# EAGLE board AFIBRPIComputeBoard (EAGLE 7.3.0)
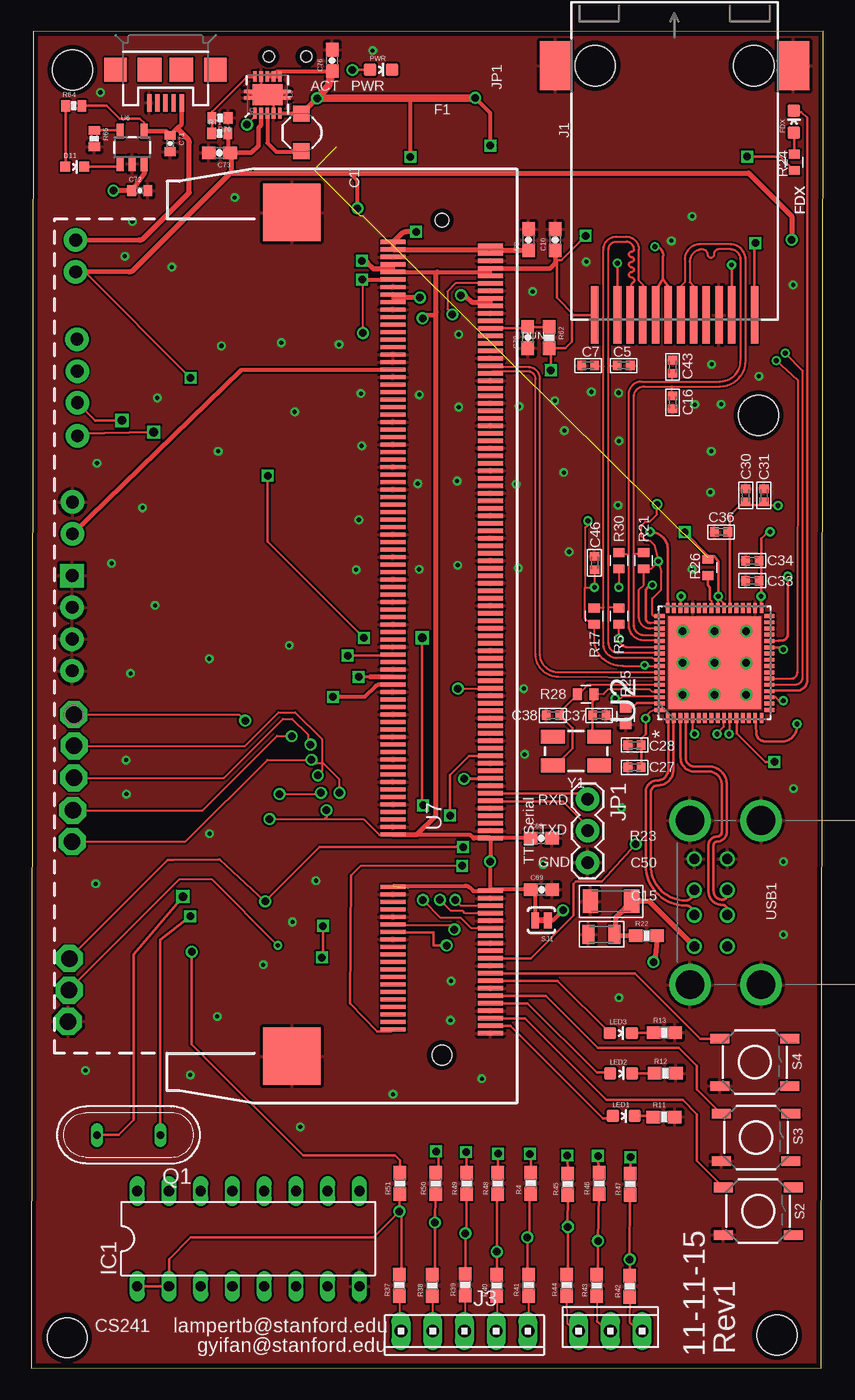
[diagram p3: board, top side]
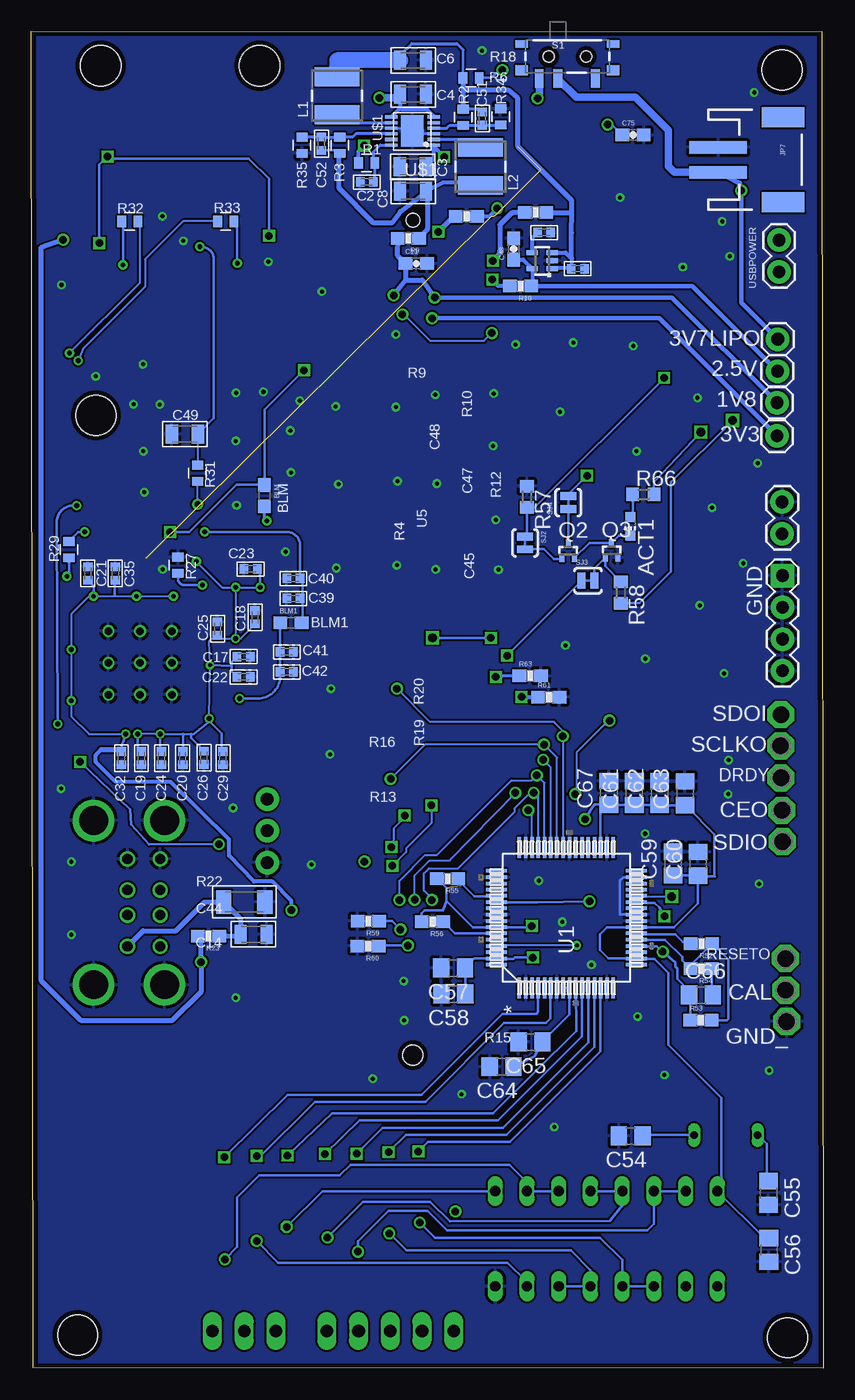
[diagram p4: board, bottom side, seen from below]

Size 63.4 x 106.98 mm. Coordinates in mm from the lower left corner, seen from the top.
Outline: 0,0 63.23,0.05 63.4,106.98 0.15,106.96 0,0
Copper layers (1*16): Top 0.0356mm / dielectric 1.5011mm / Bottom 0.0356mm
Design rules "LaenPCBOrder": minimum track width 6mil, minimum drill 13mil, track to track 6mil, track to pad 6mil, pad to pad 6mil, via to via 6mil, smd to smd 6mil, copper to edge 15mil, drill to drill 6mil, minimum pad ring 7mil, minimum via ring 7mil, stop-mask expansion 3mil, vias tented up to drill 0mil, thermal gap 10mil
Holes 3.2 mm at 3.3,103.89 2.87,2.44 59.69,2.67 58.22,76.25

## Footprints (pad centres in the part's own frame; a part is rotated, then mirrored left to right if it is on the bottom)
1X01 = drill 1.016 pad 1.88: 1 0,0
CHIP-LED0603 = smd 0.8 x 0.8: A 0,-0.75; C 0,0.75
0603 = smd 1.1 x 1: 1 -0.85,0; 2 0.85,0
0402 = smd 0.686 x 0.762: 1 -0.533,0; 2 0.533,0
0805 = smd 0.965 x 1.524: 1 -1.041,0; 2 1.041,0
0603-CAP = smd 1.1 x 1: 1 -0.85,0; 2 0.85,0
1206 = smd 1.219 x 1.88: 1 -1.651,0; 2 1.651,0
C0805 = smd 1.3 x 1.5: 1 -0.95,0; 2 0.95,0
0402-CAP = smd 0.7 x 0.9: 1 -0.65,0; 2 0.65,0
P1-13 = drill 1.321 pad 2.159 octagon: TP 0,0
LED-0603 = smd 0.8 x 0.8: A 0,-0.75; C 0,0.75
LED-0603' = smd 1 x 1: A 0,-0.877; C 0,0.877
1X04 = drill 1.016 pad 1.88 square: 1 0,0 | drill 1.016 pad 1.88: 2 2.54,0; 3 5.08,0; 4 7.62,0
DIL16 = drill 0.813 long: 1 -8.89,-3.81; 2 -6.35,-3.81; 3 -3.81,-3.81; 4 -1.27,-3.81; 5 1.27,-3.81; 6 3.81,-3.81; 7 6.35,-3.81; 8 8.89,-3.81; 9 8.89,3.81; 10 6.35,3.81; 11 3.81,3.81; 12 1.27,3.81; 13 -1.27,3.81; 14 -3.81,3.81; 15 -6.35,3.81; 16 -8.89,3.81
J30 = smd 0.61 x 4.597: 1 -6.401,-19.939; 2 -4.572,-19.939; 3 -3.556,-19.939; 4 -2.54,-19.939; 5 -1.524,-19.939; 6 -0.508,-19.939; 7 0.508,-19.939; 8 1.524,-19.939; 9 2.54,-19.939; 10 3.556,-19.939; 11 4.572,-19.939; 12 6.401,-19.939 | smd 2.489 x 3.912: S1 -9.525,0; S2 9.525,0 | hole 3.251: 6.35,0; -6.35,0
10X03MTA = drill 1.016 long: 1 2.54,0; 2 0,0; 3 -2.54,0
10X05MTA = drill 1.016 long: 1 5.08,0; 2 2.54,0; 3 0,0; 4 -2.54,0; 5 -5.08,0
1X03 = drill 1.016 pad 1.88: 1 0,0; 2 2.54,0; 3 5.08,0
USB-MICRO = smd 0.35 x 1.4: D+ 0,2.65; D- -0.65,2.65; GND 1.3,2.65; ID 0.65,2.65; VBUS -1.3,2.65 | smd 1.8 x 1.9: MT1 -4,0; MT2 4,0 | smd 1.9 x 1.9: P$1 -1.27,0; P$2 1.27,0
1X02 = drill 1.016 pad 1.88: 1 0,0; 2 2.54,0
JST-2-SMD = smd 1 x 4.6: 1 -1,-3.7; 2 1,-3.7 | smd 1.6 x 3.4: NC1 -3.4,1.5; NC2 3.4,1.5
SRN4018 = smd 1.5 x 3.6: P$1 -1.525,0; P$2 1.525,0
CDRH2D09 = smd 1.3 x 1.3: P$1 -1.5,0; P$2 1.5,0
QS = drill 0.61 long: 1 -2.54,0; 2 2.54,0
SC75_INFINEON = smd 0.4 x 0.65: 1 -0.5,-0.575; 2 0,0.575; 3 0.5,-0.575
0402-RES = smd 0.7 x 0.9: 1 -0.65,0; 2 0.65,0
0603-RES = smd 1.1 x 1: 1 -0.85,0; 2 0.85,0
R0603 = smd 1 x 1.1: 1 -0.85,0; 2 0.85,0
SWITCH-SPST-SMD-A = smd 0.7 x 1.5: 1 -2.25,-1.75; 2 -0.75,-1.75; 3 2.25,-1.75 | smd 1 x 0.6: GND1 -3.65,1; GND3 3.65,1 | smd 1 x 0.8: GND2 -3.65,-1.1; GND4 3.65,-1.1 | hole 0.9: -1.5,0; 1.5,0
TACTILE-SWITCH-SMD = smd 1.524 x 0.762: 1 -2.794,1.905; 2 2.794,1.905; 3 -2.794,-1.905; 4 2.794,-1.905
SJ_2S-TRACE = smd 0.635 x 1.27: 1 -0.508,0; 2 0.508,0
ST_64_2 = smd 1.676 x 0.279: 1 -5.613,3.759; 2 -5.613,3.251; 3 -5.613,2.743; 4 -5.613,2.261; 5 -5.613,1.753; 6 -5.613,1.245; 7 -5.613,0.762; 8 -5.613,0.254; 9 -5.613,-0.254; 10 -5.613,-0.762; 11 -5.613,-1.245; 12 -5.613,-1.753; 13 -5.613,-2.261; 14 -5.613,-2.743; 15 -5.613,-3.251; 16 -5.613,-3.759; 33 5.613,-3.759; 34 5.613,-3.251; 35 5.613,-2.743; 36 5.613,-2.261; 37 5.613,-1.753; 38 5.613,-1.245; 39 5.613,-0.762; 40 5.613,-0.254; 41 5.613,0.254; 42 5.613,0.762; 43 5.613,1.245; 44 5.613,1.753; 45 5.613,2.261; 46 5.613,2.743; 47 5.613,3.251; 48 5.613,3.759 | smd 0.279 x 1.676: 17 -3.759,-5.613; 18 -3.251,-5.613; 19 -2.743,-5.613; 20 -2.261,-5.613; 21 -1.753,-5.613; 22 -1.245,-5.613; 23 -0.762,-5.613; 24 -0.254,-5.613; 25 0.254,-5.613; 26 0.762,-5.613; 27 1.245,-5.613; 28 1.753,-5.613; 29 2.261,-5.613; 30 2.743,-5.613; 31 3.251,-5.613; 32 3.759,-5.613; 49 3.759,5.613; 50 3.251,5.613; 51 2.743,5.613; 52 2.261,5.613; 53 1.753,5.613; 54 1.245,5.613; 55 0.762,5.613; 56 0.254,5.613; 57 -0.254,5.613; 58 -0.762,5.613; 59 -1.245,5.613; 60 -1.753,5.613; 61 -2.261,5.613; 62 -2.743,5.613; 63 -3.251,5.613; 64 -3.759,5.613
QFN50P900X900X100-65N = smd 0.813 x 0.305: 1 -4.394,3.759; 2 -4.394,3.251; 3 -4.394,2.743; 4 -4.394,2.261; 5 -4.394,1.753; 6 -4.394,1.245; 7 -4.394,0.762; 8 -4.394,0.254; 9 -4.394,-0.254; 10 -4.394,-0.762; 11 -4.394,-1.245; 12 -4.394,-1.753; 13 -4.394,-2.261; 14 -4.394,-2.743; 15 -4.394,-3.251; 16 -4.394,-3.759; 33 4.394,-3.759; 34 4.394,-3.251; 35 4.394,-2.743; 36 4.394,-2.261; 37 4.394,-1.753; 38 4.394,-1.245; 39 4.394,-0.762; 40 4.394,-0.254; 41 4.394,0.254; 42 4.394,0.762; 43 4.394,1.245; 44 4.394,1.753; 45 4.394,2.261; 46 4.394,2.743; 47 4.394,3.251; 48 4.394,3.759 | smd 0.305 x 0.813: 17 -3.759,-4.394; 18 -3.251,-4.394; 19 -2.743,-4.394; 20 -2.261,-4.394; 21 -1.753,-4.394; 22 -1.245,-4.394; 23 -0.762,-4.394; 24 -0.254,-4.394; 25 0.254,-4.394; 26 0.762,-4.394; 27 1.245,-4.394; 28 1.753,-4.394; 29 2.261,-4.394; 30 2.743,-4.394; 31 3.251,-4.394; 32 3.759,-4.394; 49 3.759,4.394; 50 3.251,4.394; 51 2.743,4.394; 52 2.261,4.394; 53 1.753,4.394; 54 1.245,4.394; 55 0.762,4.394; 56 0.254,4.394; 57 -0.254,4.394; 58 -0.762,4.394; 59 -1.245,4.394; 60 -1.753,4.394; 61 -2.261,4.394; 62 -2.743,4.394; 63 -3.251,4.394; 64 -3.759,4.394 | smd 7.391 x 7.391: 65 0,0 | drill 0.6: GND@1 -2.54,2.54; GND@2 0,2.54; GND@3 2.54,2.54; GND@4 -2.54,0; GND@5 0,0; GND@6 2.54,0; GND@7 -2.54,-2.54; GND@8 0,-2.54; GND@9 2.54,-2.54
SOT353 = smd 0.4 x 0.9: 1 -0.65,-0.8; 2 0,-0.8; 3 0.65,-0.8; 4 0.65,0.8; 5 -0.65,0.8
SOT23-5 = smd 0.55 x 1.2: 1 -0.95,-1.3; 2 0,-1.3; 3 0.95,-1.3; 4 0.95,1.3; 5 -0.95,1.3
SO-DIMM = smd 0.35 x 2: 1 -26.4,-3.9; 2 -26.1,3.9; 3 -25.8,-3.9; 4 -25.5,3.9; 5 -25.2,-3.9; 6 -24.9,3.9; 7 -24.6,-3.9; 8 -24.3,3.9; 9 -24,-3.9; 10 -23.7,3.9; 11 -23.4,-3.9; 12 -23.1,3.9; 13 -22.8,-3.9; 14 -22.5,3.9; 15 -22.2,-3.9; 16 -21.9,3.9; 17 -21.6,-3.9; 18 -21.3,3.9; 19 -21,-3.9; 20 -20.7,3.9; 21 -20.4,-3.9; 22 -20.1,3.9; 23 -19.8,-3.9; 24 -19.5,3.9; 25 -19.2,-3.9; 26 -18.9,3.9; 27 -18.6,-3.9; 28 -18.3,3.9; 29 -18,-3.9; 30 -17.7,3.9; 31 -17.4,-3.9; 32 -17.1,3.9; 33 -16.8,-3.9; 34 -16.5,3.9; 35 -16.2,-3.9; 36 -15.9,3.9; 37 -15.6,-3.9; 38 -15.3,3.9; 39 -15,-3.9; 40 -14.7,3.9; 41 -10.8,-3.9; 42 -10.5,3.9; 43 -10.2,-3.9; 44 -9.9,3.9; 45 -9.6,-3.9; 46 -9.3,3.9; 47 -9,-3.9; 48 -8.7,3.9; 49 -8.4,-3.9; 50 -8.1,3.9; 51 -7.8,-3.9; 52 -7.5,3.9; 53 -7.2,-3.9; 54 -6.9,3.9; 55 -6.6,-3.9; 56 -6.3,3.9; 57 -6,-3.9; 58 -5.7,3.9; 59 -5.4,-3.9; 60 -5.1,3.9; 61 -4.8,-3.9; 62 -4.5,3.9; 63 -4.2,-3.9; 64 -3.9,3.9; 65 -3.6,-3.9; 66 -3.3,3.9; 67 -3,-3.9; 68 -2.7,3.9; 69 -2.4,-3.9; 70 -2.1,3.9; 71 -1.8,-3.9; 72 -1.5,3.9; 73 -1.2,-3.9; 74 -0.9,3.9; 75 -0.6,-3.9; 76 -0.3,3.9; 77 0,-3.9; 78 0.3,3.9; 79 0.6,-3.9; 80 0.9,3.9; 81 1.2,-3.9; 82 1.5,3.9; 83 1.8,-3.9; 84 2.1,3.9; 85 2.4,-3.9; 86 2.7,3.9; 87 3,-3.9; 88 3.3,3.9; 89 3.6,-3.9; 90 3.9,3.9; 91 4.2,-3.9; 92 4.5,3.9; 93 4.8,-3.9; 94 5.1,3.9; 95 5.4,-3.9; 96 5.7,3.9; 97 6,-3.9; 98 6.3,3.9; 99 6.6,-3.9; 100 6.9,3.9; 101 7.2,-3.9; 102 7.5,3.9; 103 7.8,-3.9; 104 8.1,3.9; 105 8.4,-3.9; 106 8.7,3.9; 107 9,-3.9; 108 9.3,3.9; 109 9.6,-3.9; 110 9.9,3.9; 111 10.2,-3.9; 112 10.5,3.9; 113 10.8,-3.9; 114 11.1,3.9; 115 11.4,-3.9; 116 11.7,3.9; 117 12,-3.9; 118 12.3,3.9; 119 12.6,-3.9; 120 12.9,3.9; 121 13.2,-3.9; 122 13.5,3.9; 123 13.8,-3.9; 124 14.1,3.9; 125 14.4,-3.9; 126 14.7,3.9; 127 15,-3.9; 128 15.3,3.9; 129 15.6,-3.9; 130 15.9,3.9; 131 16.2,-3.9; 132 16.5,3.9; 133 16.8,-3.9; 134 17.1,3.9; 135 17.4,-3.9; 136 17.7,3.9; 137 18,-3.9; 138 18.3,3.9; 139 18.6,-3.9; 140 18.9,3.9; 141 19.2,-3.9; 142 19.5,3.9; 143 19.8,-3.9; 144 20.1,3.9; 145 20.4,-3.9; 146 20.7,3.9; 147 21,-3.9; 148 21.3,3.9; 149 21.6,-3.9; 150 21.9,3.9; 151 22.2,-3.9; 152 22.5,3.9; 153 22.8,-3.9; 154 23.1,3.9; 155 23.4,-3.9; 156 23.7,3.9; 157 24,-3.9; 158 24.3,3.9; 159 24.6,-3.9; 160 24.9,3.9; 161 25.2,-3.9; 162 25.5,3.9; 163 25.8,-3.9; 164 26.1,3.9; 165 26.4,-3.9; 166 26.7,3.9; 167 27,-3.9; 168 27.3,3.9; 169 27.6,-3.9; 170 27.9,3.9; 171 28.2,-3.9; 172 28.5,3.9; 173 28.8,-3.9; 174 29.1,3.9; 175 29.4,-3.9; 176 29.7,3.9; 177 30,-3.9; 178 30.3,3.9; 179 30.6,-3.9; 180 30.9,3.9; 181 31.2,-3.9; 182 31.5,3.9; 183 31.8,-3.9; 184 32.1,3.9; 185 32.4,-3.9; 186 32.7,3.9; 187 33,-3.9; 188 33.3,3.9; 189 33.6,-3.9; 190 33.9,3.9; 191 34.2,-3.9; 192 34.5,3.9; 193 34.8,-3.9; 194 35.1,3.9; 195 35.4,-3.9; 196 35.7,3.9; 197 36,-3.9; 198 36.3,3.9; 199 36.6,-3.9; 200 36.9,3.9 | smd 4.6 x 4.6: G1 -28.254,12; G2 39.27,12 | hole 1.6: -28.15,0 | hole 1.1: 38.65,0
QFN-10_PAD = smd 0.297 x 0.85: 1 -1,-1.475; 2 -0.5,-1.475; 3 0,-1.475; 4 0.5,-1.475; 5 1,-1.475; 6 1,1.475; 7 0.5,1.475; 8 0,1.475; 9 -0.5,1.475; 10 -1,1.475 | smd 0.7 x 0.28: 11 -1.5,0.25; 12 -1.5,-0.25; 13 1.5,0.25; 14 1.5,-0.25 | smd 2.4 x 1.65: 15 0,0
WDFN-12L = smd 1 x 0.25: 1 -2.2,3.6; 2 -2.2,3.15; 3 -2.2,2.7; 4 -2.2,2.25; 5 -2.2,1.8; 6 -2.2,1.35; 7 1.2,1.35; 8 1.2,1.8; 9 1.2,2.25; 10 1.2,2.7; 11 1.2,3.15; 12 1.2,3.6 | smd 1.8 x 2.525: GND -0.5,2.48
72309 = drill 0.813: A1_5V+ -3.5,2.62; A2_D- -1,2.62; A3_D+ 1,2.62; A4_GND 3.5,2.62; B1_5V+ -3.5,0; B2_D- -1,0; B3_D+ 1,0; B4_GND 3.5,0 | drill 2.3: GND@1 -6.57,2.97; GND@2 -6.57,-2.71; GND@3 6.57,-2.71; GND@4 6.57,2.97
CRYSTAL-SMD-5X3 = smd 1.9 x 1.1: 1 -1.85,-1.15; 2 1.85,-1.15; 3 1.85,1.15; 4 -1.85,1.15

## Placement (x,y rotation side)
1V8  M01PTH  [1X01]  3.71,77.27 0 bottom
2.5V  M01PTH  [1X01]  3.68,79.78 0 bottom
3V3  M01PTH  [1X01]  3.71,74.6 0 bottom
3V7LIPO  M01PTH  [1X01]  3.66,82.35 90 bottom
ACT1  [CHIP-LED0603]  15.47,67.36 180 bottom
BLM  BLM18AG601  [0603]  44.73,69.82 270 bottom
BLM1  BLM18AG601  [0603]  42.62,59.64 0 bottom
C2  100nF  [0402]  36.55,94.92 180 bottom
C3  10uF  [0805]  32.87,96.14 180 bottom
C4  10uF  [0805]  32.84,101.93 0 bottom
C5  15pf 50V 5%  [0402]  47.42,80.24 0 top
C6  10uF  [0805]  32.84,104.65 0 bottom
C7  15pf 50V 5%  [0402]  44.58,80.24 180 top
C8  10uF  [0805]  32.84,94.18 180 bottom
C9  47uF  [0603-CAP]  39.8,90.3 90 top
C10  47uF  [0603-CAP]  41.94,90.3 90 top
C11  47uF  [0603-CAP]  32.59,88.39 0 bottom
C14  100uF 10v  [1206]  46.41,37.36 180 top
C15  100uF 10v  [1206]  46.36,37.31 0 bottom
C16  15pf 50V 5%  [0402]  51.33,77.29 270 top
C17  100nF  [0402]  46.41,56.95 0 bottom
C18  100nF  [0402]  45.49,60.1 90 bottom
C19  100nF  [0402]  54.58,48.82 270 bottom
C20  100nF  [0402]  51.28,48.82 270 bottom
C21  4u7  [0402]  58.88,63.6 90 bottom
C22  100nF  [0402]  46.41,55.32 0 bottom
C23  100nF  [0402]  45.85,63.96 180 bottom
C24  100nF  [0402]  52.98,48.82 270 bottom
C25  100nF  [0402]  48.49,59.18 90 bottom
C26  100nF  [0402]  49.58,48.84 270 bottom
C27  100nF  [0402]  48.29,48.08 180 top
C28  100nF  [0402]  48.29,49.86 180 top
C29  100nF  [0402]  48.06,48.82 270 bottom
C30  100nF  [0402]  57.18,69.85 90 top
C31  100nF  [0402]  58.65,69.85 90 top
C32  100nF  [0402]  56.18,48.82 270 bottom
C33  100nF  [0402]  57.71,63.02 180 top
C34  100nF  [0402]  57.71,64.62 180 top
C35  100nF  [0402]  56.67,63.6 90 bottom
C36  4u7  [0402]  55.22,66.93 180 top
C37  12pf  [0402]  45.47,52.25 0 top
C38  12pf  [0402]  41.76,52.25 180 top
C39  100nF  [0402]  42.42,61.59 180 bottom
C40  100nF  [0402]  42.42,63.2 180 bottom
C41  100nF  [0402]  42.95,57.33 0 bottom
C42  100nF  [0402]  42.95,55.73 0 bottom
C43  15pf 50V 5%  [0402]  51.33,80.14 90 top
C44  47uf 10v  [0805]  45.64,34.72 180 top
C45  1uF  [0402]  19.66,87.99 0 bottom
C46  100nF  [0402]  45.09,64.44 90 top
C47  100nF  [0402]  22.35,90.88 0 bottom
C48  4.7uF  [0603-CAP]  24.79,89.56 90 bottom
C49  22nF  [0805]  51.1,74.75 180 bottom
C50  47uF 10V  [0805]  45.62,34.72 0 bottom
C51  100pF  [0402]  27.3,100 270 bottom
C52  100pF  [0402]  40.18,97.99 90 bottom
C54  15pF  [C0805]  15.42,18.59 180 bottom
C55  15pF  [C0805]  4.39,14.02 270 bottom
C56  0.1uF  [C0805]  4.37,9.47 270 bottom
C57  0.1uF  [C0805]  29.64,32.03 180 bottom
C58  0.1uF  [C0805]  29.62,29.95 180 bottom
C59  0.1uF  [C0805]  12.04,40.39 90 bottom
C60  4.7uF  [C0805]  10.03,40.36 90 bottom
C61  4.7uF  [C0805]  15.14,46.02 90 bottom
C62  0.1uF  [C0805]  13.11,46.02 90 bottom
C63  0.1uF  [C0805]  11.07,46 90 bottom
C64  10uF  [C0805]  25.76,24.13 180 bottom
C65  0.1uF  [C0805]  23.44,26.11 180 bottom
C66  2.2nF  [C0805]  9.8,29.87 0 bottom
C67  4.7uF  [C0805]  17.17,46.05 90 bottom
C68  10u  [0603-CAP]  40.82,42.42 0 top
C69  10u  [0603-CAP]  40.84,38.3 0 top
C70  0.1uF  [0603-CAP]  39.75,82.47 90 top
C71  4.7uF  [0402-CAP]  11.13,97.99 270 top
C72  4.7uF  [0402-CAP]  8.69,94.23 0 top
C73  22uF  [0603-CAP]  15.06,97.26 180 top
C75  0.1uF  [0603-CAP]  15.24,98.68 0 bottom
C76  10uF  [0603-CAP]  24.08,104.65 90 top
CAL  TPPAD1-13  [P1-13]  3.02,30.25 270 bottom
CEO  TPPAD1-13  [P1-13]  3.33,44.65 90 bottom
D11  CHARGING  [LED-0603]  3.48,96.14 270 top
DRDY  TPPAD1-13  [P1-13]  3.4,47.24 90 bottom
FDX  GREEN  [LED-0603']  61.04,99.75 0 top
GND  [1X04]  3.28,63.42 270 bottom
GND_  TPPAD1-13  [P1-13]  2.95,27.74 90 bottom
IC1  SP720  [DIL16]  17.37,10.36 0 top
J1  J3011  [J30]  51.49,104.22 0 top
J2  JUMPERS  [10X03MTA]  46.36,2.97 0 top
J3  JUMPERS  [10X05MTA]  34.67,2.97 180 top
JP1  [1X03]  44.53,45.54 270 top
JP3  USB-IDMICRO  [USB-MICRO]  10.74,103.91 180 top
JP4  TVDAC  [1X02]  3.3,66.78 90 bottom
JP7  LiPo Battery  [JST-2-SMD]  4.72,96.7 270 bottom
L1  4.7u 2A  [SRN4018]  38.91,101.83 90 bottom
L2  4.7u 2A  [SRN4018]  27.46,96.16 270 bottom
L3  4.7uH, 1.2A  [CDRH2D09]  21.62,98.88 90 top
LED1  [LED-0603']  47.42,20.19 270 top
LED2  [LED-0603']  47.22,23.6 270 top
LED3  [LED-0603']  47.19,26.82 270 top
PWR  RED  [LED-0603']  27.99,103.91 270 top
Q1  8.192MHz  [QS]  7.8,18.67 180 top
Q2  DMG1012T  [SC75_INFINEON]  20.42,65.43 0 bottom
Q3  DMG1012T  [SC75_INFINEON]  16.97,65.46 0 bottom
R1  100K 1%  [0402-RES]  36.55,96.44 180 bottom
R2  540k 1%  [0402-RES]  28.83,100.1 90 bottom
R3  240k 1%  [0402-RES]  38.71,97.87 270 bottom
R4  500  [0603-RES]  39.98,14.81 90 top
R5  49R9 1%  [0402-RES]  47.04,60.17 90 top
R6  470R 1%  [0402-RES]  28.19,103.25 180 bottom
R7  0R 1%  [0603-RES]  28.58,92.18 180 bottom
R8  0R 1%  [0603-RES]  23.04,92.48 180 bottom
R9  0R 1%  [0603-RES]  33.22,90.42 180 bottom
R10  0R 1%  [0603-RES]  24.23,86.59 180 bottom
R11  [0603-RES]  50.65,20.12 0 top
R12  [0603-RES]  50.75,23.6 0 top
R13  [0603-RES]  50.67,26.87 0 top
R17  49R9 1%  [0402-RES]  45.06,60.17 90 top
R21  49R9 1%  [0402-RES]  49.02,64.62 90 top
R22  0R 1%  [0603-RES]  49.25,34.62 0 top
R23  0R 1%  [0603-RES]  49.23,34.59 180 bottom
R24  1K0 1%  [0402-RES]  61.06,96.49 90 top
R25  12K 1%  [0402-RES]  47.57,52.17 90 top
R26  10K 1%  [0402-RES]  54.15,64.08 270 top
R27  12K4 1%  [0402-RES]  51.66,64.26 270 bottom
R28  1M0 1%  [0402-RES]  44.37,53.92 180 top
R29  10K 1%  [0402-RES]  60.38,65.51 90 bottom
R30  49R9 1%  [0402-RES]  47.04,64.62 90 top
R31  10R 1%  [0402-RES]  50.09,71.63 90 bottom
R32  1K0 1%  [0402-RES]  55.52,91.77 0 bottom
R33  1K0 1%  [0402-RES]  47.83,91.77 180 bottom
R34  120k 1%  [0402-RES]  25.83,100.13 270 bottom
R35  120k 1%  [0402-RES]  41.73,97.87 90 bottom
R37  4.5k  [0603-RES]  29.46,6.65 90 top
R38  4.5k  [0603-RES]  32.11,6.63 90 top
R39  4.5k  [0603-RES]  34.72,6.68 90 top
R40  4.5k  [0603-RES]  37.26,6.63 90 top
R41  4.5k  [0603-RES]  39.8,6.65 90 top
R42  4.5k  [0603-RES]  47.9,6.55 90 top
R43  4.5k  [0603-RES]  45.26,6.63 90 top
R44  4.5k  [0603-RES]  42.85,6.65 90 top
R45  500  [0603-RES]  42.95,14.73 90 top
R46  500  [0603-RES]  45.44,14.78 90 top
R47  500  [0603-RES]  47.93,14.73 90 top
R48  500  [0603-RES]  37.34,14.78 90 top
R49  500  [0603-RES]  34.85,14.78 90 top
R50  500  [0603-RES]  32.36,14.78 90 top
R51  500  [0603-RES]  29.51,14.78 90 top
R52  40K  [0603-RES]  9.75,33.99 180 bottom
R53  4M  [0603-RES]  9.8,27.84 0 bottom
R54  100K  [0603-RES]  9.78,31.98 180 bottom
R55  5K  [0603-RES]  30.07,39.19 180 bottom
R56  5K  [0603-RES]  31.29,35.74 180 bottom
R57  47k  [R0603]  23.72,69.72 270 bottom
R58  47k  [R0603]  16.21,62.08 270 bottom
R59  100k  [0603-RES]  36.42,35.79 180 bottom
R60  100k  [0603-RES]  36.45,33.78 180 bottom
R61  100k  [0603-RES]  21.97,53.7 0 bottom
R62  10K  [0603-RES]  41.45,82.47 270 top
R63  100k  [0603-RES]  23.47,55.4 0 bottom
R64  330  [0402-RES]  3.4,101.02 0 top
R65  2K  [0402-RES]  5.05,98.4 270 top
R66  1k8  [R0603]  14.4,69.93 0 bottom
R70  220k  [0402-RES]  15.11,100.05 180 top
R71  2M  [0402-RES]  15.09,98.81 0 top
RESETO  TPPAD1-13  [P1-13]  3.05,32.79 270 bottom
S1  [SWITCH-SPST-SMD-A]  20.5,104.95 0 bottom
S2  SWITCH-MOMENTARY-2SMD  [TACTILE-SWITCH-SMD]  58.19,12.57 0 top
S3  SWITCH-MOMENTARY-2SMD  [TACTILE-SWITCH-SMD]  58.01,18.47 0 top
S4  SWITCH-MOMENTARY-2SMD  [TACTILE-SWITCH-SMD]  57.91,24.49 0 top
SCLKO  TPPAD1-13  [P1-13]  3.43,49.81 90 bottom
SDIO  TPPAD1-13  [P1-13]  3.28,42.14 90 bottom
SDOI  TPPAD1-13  [P1-13]  3.4,52.3 90 top
SJ1  SOLDERJUMPERTRACE  [SJ_2S-TRACE]  40.84,35.84 180 top
SJ2  SOLDERJUMPERTRACE  [SJ_2S-TRACE]  23.88,66.04 270 bottom
SJ3  SOLDERJUMPERTRACE  [SJ_2S-TRACE]  18.85,63.02 0 bottom
SJ4  SOLDERJUMPERTRACE  [SJ_2S-TRACE]  20.42,69.27 90 bottom
U1  ADAS1000BSTZ  [ST_64_2]  20.57,36.04 90 bottom
U2  LAN9512-JZX  [QFN50P900X900X100-65N]  54.69,56.44 90 top
U5  AP7115-25SEG  [SOT353]  22.5,88.62 90 bottom
U6  MCP73831  [SOT23-5]  8.08,97.69 0 top
U7  RASPI  [SO-DIMM]  32.87,53.21 90 top
U8  TPS61200  [QFN-10_PAD]  18.9,101.9 0 top
U$1  [WDFN-12L]  33.4,101.47 180 bottom
USB1  72309USB-TYPE-A  [72309]  55.7,37.26 90 top
USBPOWER  [1X02]  3.56,87.73 90 bottom
Y1  [CRYSTAL-SMD-5X3]  43.61,49.38 0 top

## Tracks (layer width: path | path; a pad name or v marks a point on that pad's centre or on a via)
1V8
  Bottom 0.203: C52.1 38.71,97.46 R3.2
  Bottom 0.305: L2.P$2 27.51,94.64 27.74,94.87 30.45,94.87 C8.1
  Bottom 0.406: R9.1 31.7,91.15 31.7,93.5 C8.1 31.78,93.8 32.03,93.9 33.86,92.56 34.54,91.64 35.99,91.64 38.76,94.41 38.76,97.17 R3.2
3V3  (via drill 0.38, 0.6)  (4 unrouted)
  Top 0.152: v52.02,61.77 52.02,61.42 51.94,61.34 U2.46
  Top 0.178: v55.85,50.75 55.93,51.36 U2.11 | U2.39 55.4,60.88 55.4,61.24 55.04,61.59 v54.99,61.77 54.99,60.93 U2.40 | 54.57,64.97 54.33,64.97 54.2,64.85
  Top 0.203: 54.57,64.97 54.69,64.97 54.99,64.57 v54.99,61.77 | v58.42,61.77 58.42,62.84 | 58.42,62.84 58.42,64.44 | 58.42,64.44 58.42,66.4 58.95,66.93 v59.13,66.93 | C33.1 58.42,62.84 | C34.1 58.42,64.44 | U2.27 60.02,57.68 v60.2,57.51 | v60.2,53.42 59.84,53.42 59.56,53.7 59.21,53.7 59.13,53.64 U2.19 | 58.42,60.78 58.45,60.81 U2.33
  Top 0.254: 58.42,60.78 v58.42,61.77
  Top 0.305: SJ1.1 41.76,35.84 v42.57,36.65
  Bottom 0.178: v55.85,50.75 58.78,50.75 60.2,52.17 v60.2,53.42 v60.2,57.51 60.2,60.35 58.78,61.77 v58.42,61.77 56.72,61.77 v54.99,61.77 v52.02,61.77
  Bottom 0.203: v59.13,66.93 59.66,66.93 60.38,66.22 R29.2 | C21.1 58.42,62.61 v58.42,61.77 | C35.1 56.72,63.17 56.72,61.77 | v55.85,50.75 56.03,50.11 56.18,49.86 C32.1 | 28.84,105.5 R6.2
  Bottom 0.254: C6.1 33.88,105.05 32.94,105.99 29.34,105.99 28.84,105.5 | C51.1 27.52,100.75 R2.2 | R6.2 28.83,103.24
  Bottom 0.305: L1.P$2 38.99,103.35 39.12,103.23 | 21.97,89.31 21.93,89.27 U5.3 20.64,89.27 20.17,88.8 20.17,88.01 C45.1 20.27,88.06 21.56,88.06 21.66,87.97 U5.1 | 28.7,102.26 28.83,102.23 | v42.57,36.65 42.57,37.41 44.09,38.94 45.57,38.94 47.57,41.02 47.57,42.32 52.25,46.91 56.64,46.91 58.24,48.51 58.24,49.07 57.81,49.5
  Bottom 0.406: 28.83,103.24 28.83,102.23 R2.2 | 20.17,88.8 20.16,90.83 20.15,92.55 | 20.15,92.55 20.14,93.45 24.43,97.74 24.46,101.63 25.2,102.26 28.7,102.26 | R8.1 20.32,92.48 arc-45 20.15,92.55 | 57.81,49.5 56.18,49.5 C32.1
  Bottom 1.27: C6.1 38.91,104.65 L1.P$2
3V3_AN  (via drill 0.33, 0.38, 0.5)
  Top 0.152: U2.51 49.53,59.18 arc-90 48.64,60.07 48.64,62.31 49.02,62.69 R21.1
  Top 0.178: 50.24,57.68 47.75,57.68 arc-90 v47.04,58.39 R5.1 | R30.1 v47.04,62.48 | C46.1 v45.08,62.48 44.32,62.48 | v50.19,64.57 49.89,65.86 49.53,66.22 49.17,66.22 48.82,66.57 48.82,67.44 49.15,67.77 49.53,67.77 50.09,68.33 v50.09,69.14 | 50.19,60.17 49.89,60.17 arc-90 49.71,60.35 49.71,61.59 50.42,62.31 50.42,63.73 v50.19,64.57 | R21.1 49.59,63.97 v50.19,64.57 | 44.32,62.48 44.32,59.99 44.73,59.64 44.91,59.64 45.08,59.46 45.15,59.52 R17.1 45.06,58.22 arc90 47.37,56.21 50.27,56.21 U2.57 | v54.89,50.75 55.45,51.33 U2.10 | v53.09,50.75 52.91,51.05 52.91,51.94 52.93,51.97 U2.5 | 49.99,52.7 49.53,52.53 49.17,52.17 v49.17,51.99 | 44.32,62.48 44.32,67.28 44.55,67.46 v44.55,67.82
  Top 0.203: C27.1 C28.1 48.82,50.39 49.17,50.75 v49.17,51.99 | 50.19,60.17 50.22,60.2 U2.49 | U2.54 50.24,57.68 | 49.99,52.7 50.29,52.65 U2.64
  Bottom 0.178: v47.04,62.48 v47.04,58.39 | v47.04,62.48 v45.08,62.48 | v50.19,64.57 48.11,62.48 v47.04,62.48 | v54.89,50.75 v53.09,50.75 51.23,50.75 50.62,50.75 50.42,50.75 49.17,51.74 v49.17,51.99 v49.1,56.26 49.17,58.19 48.97,58.39 48.54,58.39 | 47.4,58.39 v47.04,58.39 | 48.54,58.39 v47.04,58.39 | C25.1 48.54,58.6 48.54,58.39 | v50.09,69.14 R31.1
  Bottom 0.203: C17.1 47.37,56.51 47.37,56.21 | 47.37,56.21 v49.1,56.26 | C22.1 47.37,55.75 47.37,56.21 | C23.1 45.34,63.88 45.08,63.88 v45.08,62.48 | C18.1 46.66,58.39 v47.04,58.39 | C20.1 51.23,49.4 51.23,50.75 | C26.1 50.62,50.42 50.62,50.75 | C24.1 53.09,49.45 v53.09,50.75 | C19.1 54.89,49.35 v54.89,50.75 | C29.1 48.18,49.48 48.18,50.8 49.17,51.79 v49.17,51.99
  Bottom 0.254: BLM.2 44.73,68 v44.55,67.82
3V7LIPO  (via drill 0.6)
  Top 0.305: L3.P$2 19.94,100.38 U8.5 | v36.75,97.84 36.75,100.43 v35.53,101.65 | v30.35,96.93 30.35,101.63
  Top 0.356: U8.5 19.9,100.35 19.91,100.33 | U8.6 U8.7 U8.8 19.72,103.76 C76.1
  Top 0.406: L3.P$2 21.64,100.38 v22.89,101.63
  Top 0.61: v35.53,101.65 35.51,101.63 30.35,101.63 v22.89,101.63 23.8,102.62 C76.1
  Bottom 0.305: C4.1 33.88,100.84 | 33.88,100.84 U$1.7 | U$1.6 31.2,100.19 31.72,100.71 33.75,100.71 33.88,100.84 | C3.1 31.2,96.76 U$1.1 31.2,97.77 v30.35,96.93 | R1.2 37.2,97.39 v36.75,97.84
  Bottom 0.61: S1.1 22.75,101.76 v22.89,101.63 | v35.53,101.65 34.16,101.65 C4.1
5V  (via drill 0.6)
  Top 0.203: v12.75,79.25 4.27,87.73
  Top 0.305: R71.2 15.74,97.43 C73.1 | v26.11,92.81 26.11,95.02 25.5,95.63
  Top 0.356: U8.2 18.4,99.47 18.19,99.26 18.19,97.84 17.6,97.26 C73.1 | 7.82,87.73 4.27,87.73 USBPOWER.1
  Top 0.406: C73.1 16,97.17 16,95.71 | 16,95.71 16.08,95.63 25.5,95.63 57.43,95.63 60.86,92.2 v60.86,90.3 | R22.2 49.9,32.6 v49.81,32.51 | 7.82,87.73 arc45 8.17,87.88 16,95.71
  Bottom 0.203: v12.75,79.25 23.13,68.87 R57.2 23.72,66.7 SJ2.1
  Bottom 0.305: R7.1 26.75,92.18 v26.11,92.81
  Bottom 0.406: v60.86,90.3 62.64,89.66 62.64,31.04 59.44,27.84 52.12,27.84 49.78,30.18 49.78,32.49 v49.81,32.51 49.81,34.53 R23.2
+5V
  Top 0.203: U6.4 9.03,99.66 8.69,100 7.06,100 6.04,101.02 R64.2
  Top 0.356: JP3.VBUS 12.04,99.56 11.69,99.21 C71.1 10.78,98.99 U6.4 | 8.63,90.27 USBPOWER.2
  Top 0.406: 8.63,90.27 arc45 8.99,90.42 12.65,94.08 12.65,98.04 arc45 12.5,98.4 11.69,99.21
CAL  (via drill 0.33)
  Top 0.178: v19.74,33.83 14.43,39.14 11.86,39.14 3.33,30.61 3.33,30.53 3.3,30.53 CAL.TP
  Bottom 0.178: v19.74,33.83 26.14,33.83 U1.61
CEO  (via drill 0.6)
  Top 0.178: v34.14,54.38 36.74,54.38 U7.81 | CEO.TP 13.72,44.65 19.66,50.6 20.83,50.6 v20.85,50.57
  Bottom 0.178: U1.41 20.83,50.55 v20.85,50.57 20.85,51 21.56,51.71 31.47,51.71 v34.14,54.38
CM_1V8  (via drill 0.6, 0.7)
  Top 0.203: v7.26,75.84 5.13,75.84 1V8.1
  Top 0.356: U7.185 U7.183
  Top 0.406: v34.39,85.85 34.77,85.8 35.28,85.29 36.49,85.29 U7.183 | v31.11,85.67 29.33,85.67 U7.184 29.01,85.35 29.01,85.85 28.97,85.89 U7.186
  Bottom 0.203: R58.2 14.72,61.23 12.19,63.75 12.19,70.92 v7.26,75.84
  Bottom 0.356: 1V8.1 12.12,85.67 v31.11,85.67
  Bottom 0.406: R9.2 34.12,89.08 C11.1 33.44,87.08 | 33.44,87.08 v34.39,85.85 | 33.44,87.08 32.09,87.08 v31.11,85.67
CM_3V3  (via drill 0.6, 0.7)  (1 unrouted)
  Top 0.178: 28.93,42.67 27.86,42.67 26.59,43.94 23.49,43.94 | v19.08,43.94 23.49,43.94 | v23.62,44.65 23.62,44.07 23.49,43.94
  Top 0.203: 28.93,42.67 U7.42 | v9.8,74.9 3.91,74.8 3V3.1 | v57.3,96.95 59.95,96.95 R24.1 | J1.12 57.89,89.97 v57.96,90.04 | v44.37,90.63 42.42,88.67 42.09,88.67 42.06,88.7 | J1.1 43.43,84.28 | 43.43,84.28 42.06,85.65 42.06,88.7 | 42.06,88.7 41.94,88.82 | 43.43,84.28 43.28,84.12 43.28,82.14 42.76,81.62 R62.2 41.58,81.5 v41.58,79.86 | R26.1 54.15,65.05 v52.3,66.9 | v23.34,35.38 23.34,32.94 v23.27,32.87
  Top 0.305: U7.192 32.49,87.71 36.47,87.71 U7.193 U7.191 | C68.1 36.78,42.42 arc45 U7.41 arc45 36.76,42.42 36.76,40.57 v36.73,40.54 36.73,38.25 U7.39 | 30.85,42.71 34.9,42.71 arc-45 35.26,42.56 35.41,42.42 | U7.39 arc-45 36.99,38.3 C69.1 40.33,37.96 SJ1.2 | U7.40 U7.40 arc-45 29.01,38.61 34.74,38.61 arc-45 35.1,38.46 35.38,38.18 36.68,38.18 arc45 U7.39
  Top 0.356: C10.1 41.94,88.82 41.94,88.5 arc-45 41.88,88.36 41.5,87.99 36.83,87.99 arc-45 U7.193 | v31.32,84.02 31.55,84.25 32.38,84.25
  Top 0.406: v26.47,88.62 26.54,88.62 arc-45 26.89,88.47 27.38,87.99 28.43,87.99 arc45 28.79,88.13 U7.194 U7.192 | U7.42 30.85,42.71 32.38,44.25 32.38,84.25 32.38,84.51 32.41,84.53 32.41,87.64 32.49,87.71 | 36.76,38.22 U7.39 | 36.76,42.42 35.41,42.42
  Bottom 0.178: U1.46 23.32,44.35 v23.62,44.65
  Bottom 0.203: C60.1 10.03,37.19 11.96,35.26 14.93,35.26 U1.23 17.35,35.28 17.91,34.72 17.91,33.48 17.22,32.79 U1.18 14.78,32.79 14.73,32.74 13.54,32.74 12.42,31.62 12.42,25.88 8.18,21.64 8.18,14.48 IC1.16 4.73,10.42 C56.1 | C59.1 10.06,39.44 C60.1 | C67.1 17.14,45.07 C61.1 C62.1 13.08,45.05 C63.1 11.07,45.03 11.2,44.91 10.9,44.91 8.71,42.72 8.71,39.37 8.69,39.34 9.97,39.34 C60.1 | C58.1 28.67,32 C57.1 27.93,32.79 U1.63 26.14,32.74 24.82,32.74 24.69,32.87 v23.27,32.87 | C67.1 18.32,45.1 v19.08,43.94 | U1.35 17.83,44.44 C67.1 | 32.11,35.71 32.13,35.74 R56.2 32.18,35.74 32.21,35.76 32.18,36.4 31.93,36.63 30.45,36.63 30.17,37.39 | 30.17,37.39 28.07,35.28 U1.58 23.44,35.28 v23.34,35.38 | 30.17,37.39 30.17,38.44 R55.2 | R66.2 13.55,70.9 v9.8,74.9 | v44.37,90.63 44.37,95.17 46,96.8 57.15,96.8 v57.3,96.95 57.96,96.29 v57.96,90.04 | v52.3,66.9 50.77,66.9 46.96,70.71 44.77,70.71 BLM.1 44.73,76.71 v41.58,79.86
  Bottom 0.356: 3V3.1 13.13,84.02 v31.32,84.02
  Bottom 0.406: R8.2 24.71,92.48 arc-45 25.07,92.33 25.91,91.49 25.91,89.39 arc45 26.06,89.03 v26.47,88.62
CM_VBAT  (via drill 0.6)
  Top 0.203: 36.47,89.51 U7.199 U7.197 36.96,89.41
  Top 0.406: 36.47,89.51 U7.198 U7.200 29.64,90.78 arc-45 30,90.93 v30.81,90.93 | C9.1 36.96,89.41
  Bottom 0.406: R7.2 arc-45 29.49,92.15 29.62,92.02 arc-45 29.79,91.95 v30.81,90.93
CM_VDAC  (via drill 0.6)
  Top 0.178: U7.189 33.96,86.81 33.3,86.16 33.3,84.73 v33.71,84.33 | v26.54,82.83 26.54,87.07 v26.49,87.12
  Top 0.305: v26.49,87.12 28.9,87.12 U7.190
  Bottom 0.178: v33.71,84.33 33.58,84.33 31.47,82.22 27.15,82.22 v26.54,82.83
  Bottom 0.305: R10.2 26.03,86.59 v26.49,87.12
CMUSBDPM_N
  Top 0.152: U2.58 42.19,55.68 arc-90 40.72,57.15 40.72,79.17 arc90 39.78,80.11 36.87,80.11 U7.167
CMUSBDPM_P
  Top 0.152: U2.59 arc90 50.14,55.22 42.19,55.32 arc-90 40.36,57.15 40.36,79.17 arc90 39.78,79.76 36.91,79.76 U7.165
DAC_2V5
  Bottom 0.305: C48.1 24.04,88.71 U5.5 23.3,86.67 R10.1
  Bottom 0.356: 2.5V.1 10.49,86.59 R10.1
DRDYI  (via drill 0.6)
  Top 0.178: v34.65,47.17 36.72,47.17 U7.57 34.68,47.21 34.65,47.24 36.86,47.24 36.88,47.22 | DRDY.TP 15.42,47.24 20.14,51.97 20.88,51.97 22.15,50.7 22.15,50.11 v22.35,49.91
  Bottom 0.178: 21.31,41.68 21.31,48.87 v22.35,49.91 31.9,49.91 v34.65,47.17
  Bottom 0.203: U1.42 21.31,41.68
ECG1_LA  (via drill 0.6)
  Top 0.203: R45.2 v42.9,17.02
  Bottom 0.203: U1.10 19.79,27 26.47,20.4 39.34,20.4 v42.9,17.02
ECG2_LL  (via drill 0.6)
  Top 0.203: R4.2 39.98,16.69 v39.9,17.14
  Bottom 0.203: U1.11 19.33,26.57 26.06,19.84 37.11,19.84 v39.9,17.14
ECG3_RA  (via drill 0.6)
  Top 0.203: R48.2 37.34,17.14 v37.36,17.17
  Bottom 0.203: U1.12 18.82,26.09 25.65,19.25 35.28,19.25 v37.36,17.17
ECG4_V1  (via drill 0.6)
  Top 0.203: R49.2 34.82,17.27 v34.8,17.3
  Bottom 0.203: U1.13 18.31,25.73 25.37,18.67 33.43,18.67 v34.8,17.3
ECG5_V2  (via drill 0.6)
  Top 0.203: R50.2 32.53,15.56 32.61,15.47 32.61,17.14 v32.41,17.35
  Bottom 0.203: U1.14 17.83,25.35 25.07,18.11 31.65,18.11 v32.41,17.35
EMMC_DISABLE_N  (via drill 0.6, 0.7)
  Top 0.178: v34.49,40.21 26.36,40.21 25.58,39.42
  Top 0.203: v18.92,71.42 18.92,66.14 v26.62,58.45 | v31.29,58.45 31.29,45.11 v31.37,45.03 | 25.58,39.42 25.5,29.18 27.66,26.95 28.8,26.95 U7.2
  Bottom 0.178: v31.37,45.03 31.37,43.64 33.4,41.61 33.4,41.3 v34.49,40.21
  Bottom 0.203: SJ4.2 20.29,70.05 v18.92,71.42 | v26.62,58.45 v31.29,58.45
EXT_RESP_LA  (via drill 0.6)
  Top 0.203: R46.2 45.36,16.69 v45.36,16.99
  Bottom 0.203: v45.36,16.99 45.31,16.71 40.69,21.34 31.85,21.34 25.55,27.64 22.2,27.64 21.84,27.99 21.84,30.4 U1.6
EXT_RESP_RA2  (via drill 0.6)
  Top 0.203: v47.95,16.89 47.95,15.33 R47.2
  Bottom 0.203: U1.4 22.83,28.5 22.99,28.35 25.7,28.35 32.18,21.89 42.87,21.89 v47.95,16.89
FB
  Top 0.203: R71.1 14.46,98.83 R70.2 14.46,100.54 17.22,103.3 17.82,103.3 U8.10
GND  (via drill 0.33)
  Top 0.178: U8.9 18.4,102.4 U8.15 | U8.15 20.15,101.9 U8.13 U8.14 | U8.15 17.65,101.9 U8.11 U8.12 | U8.15 18.9,101.73 19.41,101.22 U8.4
  Bottom 0.178: U$1.9 33.13,99.22 U$1.GND
  Bottom 0.203: U1.25 16.28,36.3 16.28,39.04 16.03,39.29 U1.31 | 32.18,98.78 U$1.3
  Bottom 0.406: U1.24 U1.25 | U$1.GND 32.18,98.99 32.18,98.78
  other vias: 47.02,78.05 44.83,78.13 54.46,80.34 58.24,79.38 55.22,77.14 53.11,77.11 54.43,73.38 47.04,74.19 41.91,77.42 42.67,75.03 42.62,71.68 54.36,70.1 60.99,86.69 52.91,92.18 51.23,90.22 44.42,88.54 40.13,86.16 34.21,82.73 34.21,76.91 34.09,70.99 34.14,64.26 26.01,63.91 26.21,67.89 26.44,73.81 26.39,78 24.64,81.92 20.02,82.07 15.21,81.81 21.08,76.53 11.25,88.11 8.1,91.77 8.92,68.86 5.26,72.42 10.08,77.65 14.96,73.38 6.43,64.41 9.91,61.04 14.25,56.77 20.65,57.84 7.95,55.6 7.59,48.67 16.28,93.68 27.33,105.44 22.78,39.01 20.9,35.71 14.27,42.77 5.16,38.76 14.88,28.14 4.34,23.83 12.73,23.47 33.55,27.84 33.6,30.99 36.07,23.16 47.04,29.64 40.97,40.31 47.24,44.83 39.5,49.12 39.42,54.38 61.01,46.38 60.2,40.54 60.2,34.7 43.05,65.33 38.99,64.03 38.81,70.74 39.04,76.96 18.57,32.28 31.06,77.9 30.94,70.79 31.04,63.93 46.96,69.06 52.88,63.93 21.54,19.3 28.96,21.92 7.62,45.95 7.49,88.98 5.54,102.08
  pour Bottom: -11.25,116.87 -11.81,-3.3 76.86,-7.67 69.09,114.22
  pour Top: -12.09,118.54 -12.73,-3.05 78.23,-8.74 74.6,114.05
GPIO0
  Top 0.203: U7.3 38.35,27.41 45.75,20.02 46.37,20.02 LED1.A
GPIO1
  Top 0.203: U7.5 39.5,28.01 46.05,21.46 52.15,21.46 53.29,20.32 53.29,16.59 S2.1
GPIO2
  Top 0.203: U7.9 39.72,29.21 45.26,23.67 46.27,23.67 LED2.A
GPIO3
  Top 0.203: U7.11 41.21,29.81 45.36,25.65 51.84,25.65 53.29,24.21 53.29,22.3 S3.1
GPIO4
  Top 0.203: U7.15 42.13,31.01 LED3.A
GPIO5
  Top 0.203: U7.17 48.3,31.61 53.57,26.34 55.07,26.34 S4.1
GPIO28  (via drill 0.6)
  Top 0.203: v33.25,33.83 32.21,33.83 32.18,34.87 29.01,34.87 U7.28
  Bottom 0.203: R60.1 35.61,33.78 35.66,33.83 v33.25,33.83
GPIO29  (via drill 0.6)
  Top 0.178: 29.02,35.46 33.5,35.46 v33.86,35.1
  Top 0.203: 29.02,35.46 U7.30
  Bottom 0.203: R59.1 34.52,35.79 v33.86,35.1
GPIO44  (via drill 0.6 pad 0.2)
  Top 0.305: U7.82 27.9,54.71 arc45 27.54,54.56 26.7,53.72 v24.16,53.72
  Bottom 0.305: v24.16,53.72 22.88,53.72 arc45 R61.1
GPIO45  (via drill 0.6 pad 0.2)
  Top 0.254: 27.12,55.31 26.22,55.31 v26.21,55.32
  Top 0.406: U7.84 27.12,55.31
  Bottom 0.254: R63.1 26.14,55.4 v26.21,55.32
GPIO47_1V8  (via drill 0.6)
  Top 0.203: v25.32,57.02 28.88,57.02 U7.90
  Bottom 0.203: SJ3.1 19.35,62.99 v25.32,57.02
JUMPERS
  Top 0.152: R42.1 47.88,3.68 J2.1
LIPODIRECT  (via drill 0.6)
  Top 0.406: U6.3 9.03,95.58 C72.1 v6.58,94.23
  Bottom 0.356: 3V7LIPO.1 6.58,85.27 v6.58,94.23
  Bottom 0.406: v6.58,94.23 6.73,94.84 JP7.2
  Bottom 0.61: S1.2 21.25,103.16 19.79,101.7 15.06,101.7 12.42,99.06 12.42,96.19 11.94,95.71 JP7.2
N$1
  Bottom 0.254: L1.P$1 37.49,99.67 U$1.8
N$2
  Bottom 0.254: U$1.4 30.15,99.21 29.91,99.45 R2.1 28.81,99.47 C51.2 27.29,99.48 R34.2
N$3
  Bottom 0.254: C2.1 35.9,95.04 R1.1 35.99,96.53 35.99,97.36 35.48,97.87 U$1.12
N$4
  Bottom 0.254: L2.P$1 28.73,98.32 U$1.2
N$5
  Top 0.305: 40.44,35.79 41.27,35.79
N$6
  Bottom 0.254: R35.2 41.72,98.53 C52.2 R3.1 37.68,98.52 37.41,98.78 U$1.10
N$7  (via drill 0.6)
  Top 0.203: v25.7,103.89 27.09,103.89 PWR.A
  Bottom 0.203: R6.1 26.7,103.25 v25.7,103.89
N$8
  Top 0.305: 40.54,35.97 41.2,35.97 41.2,35.89
N$9
  Bottom 0.203: Q2.2 SJ4.1
N$10
  Bottom 0.203: SJ3.2 18.34,64.01 Q3.1 17.47,64.19 R58.1
N$11
  Top 0.203: LED3.C 49.77,26.82 R13.1
N$12
  Top 0.203: LED2.C R12.1
N$13
  Top 0.203: R24.2 61.06,98.87 FDX.A
N$14
  Top 0.203: LED1.C 49.72,20.19 R11.1
N$15
  Bottom 0.203: SJ2.2 22.35,65.53 21.56,64.74 21.03,64.74 Q2.1
N$16
  Top 0.203: U2.63 50.24,53.24 48.46,53.24 48.05,52.82 R25.2
N$19
  Top 0.152: R37.1 29.46,3.1 J3.1
N$21
  Bottom 0.305: U5.4 23.3,90.46 C47.1
N$22  (via drill 0.38)
  Top 0.178: U2.62 50.24,53.75 47.29,53.75 47.14,53.59 v46.74,53.59
  Bottom 0.203: 43.47,57.33 43.47,57.2 43.48,57.2 C42.1 43.48,55.55 arc90 45.08,53.59 v46.74,53.59 | 43.47,57.33 BLM1.1 | C41.1 43.47,57.33
N$23  (via drill 0.38)
  Top 0.152: U2.48 50.95,60.86 50.95,60.88
  Top 0.203: 50.95,60.83 50.95,60.88 50.95,65.51 arc90 v49.53,66.93
  Bottom 0.203: BLM1.2 41.71,59.7 41.71,61.42 C39.1 | C39.1 41.92,61.63 | v49.53,66.93 42.95,66.93 arc90 41.88,65.86 C40.1 41.71,63.2 41.71,61.85 arc90 41.92,61.63 | 41.92,61.63 41.92,61.59 C39.1
N$24
  Top 0.178: 54.41,60.81 U2.41 54.43,61.42 54.33,61.52
  Top 0.203: 54.33,61.52 54.33,62.48 54.15,62.66 R26.2
N$25  (via drill 0.38)
  Top 0.178: U2.50 50.22,59.64 49.56,59.64
  Top 0.203: 49.56,59.64 arc-90 49.17,59.99 49.17,62.13 arc-90 v49.71,62.66
  Bottom 0.203: v49.71,62.66 51.13,62.66 arc90 51.66,63.2 R27.2
N$26  (via drill 0.38)
  Top 0.178: 59.84,58.22 59.82,58.19 U2.28
  Top 0.203: 59.84,58.22 60.02,58.22 arc90 60.55,58.75 v60.55,63.37
  Bottom 0.203: v60.55,63.37 60.38,63.73 60.38,64.44
  Bottom 0.254: 60.38,64.44 R29.1
N$27  (via drill 0.38)
  Top 0.203: J1.11 v56.06,88.29
  Bottom 0.203: v56.06,88.29 56.06,91.62 R32.1
N$28  (via drill 0.38)
  Top 0.203: J1.2 v46.91,88.42
  Bottom 0.203: R33.1 46.91,91.39 v46.91,88.42
N$29  (via drill 0.38)
  Top 0.203: v49.91,89.74 50.01,89.74 arc-90 50.57,88.98 50.57,87.15 | 50.57,87.15 50.98,86.54 J1.6 | J1.5 50.11,84.43 50.11,86.49 50.57,87.15
  Bottom 0.178: R31.2 50.06,72.3 C49.1
  Bottom 0.203: v49.91,89.74 arc90 48.79,88.82 48.79,76.02 C49.1
N$30
  Top 0.203: U2.20 arc-90 59.13,54.23 61.29,54.23 arc90 62.1,54.99 62.1,100.05 61.65,100.51 61.15,100.51 FDX.C
N$35
  Top 0.152: R38.1 32.11,3 J3.2
N$37
  Top 0.152: R39.1 34.72,3.02 J3.3
N$38
  Top 0.152: R40.1 37.26,3.02 J3.4
N$39
  Top 0.152: R41.1 39.8,3.02 J3.5
N$40
  Top 0.152: R43.1 45.26,3.76 J2.2
N$41
  Top 0.152: R44.1 42.87,3.61 J2.3
N$42  (via drill 0.6)
  Top 0.203: R45.1 42.93,11.33 v42.95,11.3 42.95,7.45 R44.2
  Bottom 0.203: IC1.9 40.08,14.17 v42.95,11.3
N$43  (via drill 0.6)
  Top 0.203: R46.1 v45.36,10.19 45.36,7.45 R43.2
  Bottom 0.203: IC1.7 23.72,6.91 25.27,8.46 43.64,8.46 v45.36,10.19
N$44  (via drill 0.6)
  Top 0.203: R50.1 32.33,11.68 v32.31,11.66 32.31,7.81 R38.2
  Bottom 0.203: IC1.3 IC1.4 16.1,8.66 17.88,10.44 31.09,10.44 v32.31,11.66
N$45  (via drill 0.6)
  Top 0.203: R49.1 34.82,10.87 v34.75,10.79 34.75,7.63 R39.2
  Bottom 0.203: v34.75,10.79 33.38,9.42 20.22,9.42 18.64,7.85 IC1.5 IC1.6
N$46  (via drill 0.6)
  Top 0.203: R37.2 29.46,7.77 29.64,7.95 29.64,12.37 v29.46,12.55 | v29.46,12.55 29.46,13.83 R51.1 | IC1.1 IC1.2 11.02,8.74 12.75,10.46 27.38,10.46 v29.46,12.55
N$47  (via drill 0.6)
  Top 0.203: R40.2 v37.26,9.32 37.26,13.68 R48.1
  Bottom 0.203: IC1.15 IC1.14 13.56,11.56 14.07,11.05 30.12,11.05 31.67,12.6 34.82,12.6 37.26,10.16 v37.26,9.32
N$48  (via drill 0.6)
  Top 0.203: R4.1 39.93,13.67 39.88,13.61 39.88,10.64 v39.7,10.46 39.7,7.61 R41.2
  Bottom 0.203: IC1.12 IC1.13 16.1,13.06 17.09,11.79 29.87,11.76 31.47,13.31 36.86,13.31 v39.7,10.46
N$49  (via drill 0.6)
  Top 0.203: R47.1 47.85,8.76 v47.9,8.71 R42.2 47.9,7.33
  Bottom 0.203: IC1.11 IC1.10 23.72,14.88 25.12,16.28 37.85,16.28 38.71,15.42 45.16,15.42 46.91,13.67 46.91,9.7 v47.9,8.71
N$50  (via drill 0.7)
  Top 0.203: Q1.2 6.98,18.67 8.18,19.86 8.18,33.1 v12.14,37.74
  Bottom 0.203: v12.14,37.74 14.88,37.72 U1.28 | C55.1 4.39,15.19 4.55,15.34 4.55,17.96 Q1.2
N$51  (via drill 0.6)
  Top 0.203: Q1.1 10.34,34.26 v12.73,36.17
  Bottom 0.203: v12.73,36.17 13.13,36.86 13.51,37.24 14.91,37.24 U1.27 | Q1.1 14.39,18.67 C54.1
N$52
  Bottom 0.203: R54.1 8.93,29.94 C66.2
N$53
  Bottom 0.203: R55.1 29.22,39.05 27.91,37.74 26.24,37.74 U1.53
N$54
  Bottom 0.203: U1.59 29.5,34.8 R56.1
N$55
  Bottom 0.203: R52.2 10.89,33.99 arc45 11.25,34.13 11.84,34.72 14.78,34.72 arc45 U1.22
N$56
  Bottom 0.203: C64.1 23.13,24.97 C65.1 22.49,26.15 20.32,28.32 U1.9 U1.8
N$57
  Bottom 0.203: U1.21 12.67,34.29 11.3,32.92 11.3,32.65 R54.2 10.63,32.26 R52.1 7.62,32.7 7.62,27.94 7.72,27.84 R53.2
N$60
  Bottom 0.203: ACT1.C 16.39,66.61 Q3.2 18.75,66.03 Q2.3
N$61
  Top 0.203: R64.1 2.75,96.16 D11.A
N$62
  Top 0.305: U8.3 18.9,98.04 19.58,97.36 21.59,97.36 L3.P$1
N$63  (via drill 0.6)
  Top 0.203: U8.1 17.9,100.24 v17.27,99.52
  Bottom 0.203: v17.27,99.52 16.88,99.47 C75.1
N$65
  Bottom 0.203: R66.1 15.25,68.33 ACT1.A
NLNK  (via drill 0.38)
  Top 0.178: v60.35,81.23 61.72,79.83 61.72,55.3 arc-90 61.14,54.69 U2.21
  Bottom 0.178: 54.71,91.86 54.74,91.81 54.74,86.82 v60.35,81.23
  Bottom 0.254: R32.2 54.71,91.86
NRST  (via drill 0.6)
  Top 0.203: U7.21 39.98,32.81 43.38,36.22 43.38,38.73 43.59,38.94 45.67,38.94 v48.39,41.94 | v59.49,48.51 58.75,48.51 56.49,50.77 56.49,51.99 U2.12
  Bottom 0.203: v48.39,41.94 53.95,41.91 55.42,43.51 55.47,44.7 v59.49,48.51
NSPD  (via drill 0.38)
  Top 0.178: U2.22 60.88,55.19 arc90 61.32,55.73 61.34,79.07 v59.64,80.62
  Bottom 0.178: v59.64,80.62 59.26,81.58 54.3,86.56 54.3,88.75 51.23,91.77 R33.2
PROG
  Top 0.203: R65.1 7.07,99.05 U6.5
RESETO  (via drill 0.6)
  Top 0.203: U7.63 36.48,49.01 | 36.48,49.01 36.47,49.02 | 36.48,49.01 35.04,49.01 33.5,47.47 33.5,44.25 v33.53,44.22 | v34.57,41.71 23.06,41.71 v18.72,37.36 15.06,40.72 11.35,40.67 10.92,40.67 RESETO.TP
  Bottom 0.178: v33.53,44.22 33.53,44.07 34.39,43.21 34.39,41.88 v34.57,41.71
  Bottom 0.203: U1.54 22.89,37.29 v18.72,37.36
RLD_OUT  (via drill 0.6)
  Top 0.203: R51.2 29.51,16.64 29.11,17.04 21.74,17.04 12.85,25.93 v12.85,33.32
  Bottom 0.203: U1.20 14.93,33.76 13.33,33.76 13.03,33.45 v12.85,33.32 11.84,32.49 11.84,32.11 11.71,31.98 11.71,31.14 10.75,30.19 C66.1 10.65,29.77 R53.1
RUNPIN
  Top 0.203: 37.06,83.21 39.55,83.21 arc45 39.7,83.27 C70.2 R62.1
  Top 0.356: U7.177 37.05,83.21 arc-45 37.06,83.21
RXD
  Top 0.203: U7.53 44.06,46.01 JP1.1
RXN
  Top 0.152: U2.53 arc90 50.24,58.24 49.05,58.24 arc-90 47.83,59.46 47.83,65.15 | 47.83,65.15 47.83,77.95 arc-90 48.84,78.97 51.28,78.97 | 51.28,78.97 55.14,78.97 arc90 56.77,80.59 56.77,88.72 arc90 55.96,89.53 54.97,89.53 arc88 54.66,89.15 arc-185 54.13,89.13 arc90 53.72,89.53 arc90 52.7,88.52 52.7,86.89 53.01,86.59 J1.8 | C43.1 51.28,79.55 51.28,78.97 | R30.2 47.04,65.15 47.83,65.15
RXP
  Top 0.152: U2.52 50.24,58.65 49.05,58.65 arc-90 48.23,59.46 48.23,65.15 | 48.23,65.15 48.23,77.75 arc-90 49.05,78.56 51.28,78.56 | 51.28,78.56 55.14,78.56 arc90 57.18,80.59 57.18,88.72 arc90 55.96,89.94 53.52,89.94 arc90 52.3,88.72 52.3,86.89 51.99,86.59 J1.7 | C16.1 51.28,77.88 51.28,78.56 | R21.2 49.02,65.15 48.23,65.15
SCLKO  (via drill 0.6)
  Top 0.178: U7.35 34.39,37.01 v33.93,37.46 | SCLKO.TP 17.12,49.81 19.79,52.48 21.13,52.48 23.27,50.34 23.27,47.78 v22.94,47.45
  Bottom 0.178: U1.44 22.33,46.84 v22.94,47.45 23.34,47.04 24.97,47.04 30.94,41.07 31.88,41.07 33.93,39.01 v33.93,37.46
SDIO  (via drill 0.6)
  Top 0.178: U7.33 34.73,36.41 34.54,36.6 33.6,36.6 v32.71,37.49 | v24.66,46.05 24.66,47.12 23.39,48.39 22.73,48.39 v22.43,48.69 18.9,48.69 12.34,42.14 SDIO.TP
  Bottom 0.178: U1.43 21.82,48.08 v22.43,48.69 | v32.71,37.49 32.71,39.45 31.55,40.61 29.92,40.61 v24.66,46.05
SDOI  (via drill 0.6)
  Top 0.178: U7.29 35.22,35.21 34.39,36.04 32.77,36.04 v31.34,37.46 | SDOI.TP 16.64,52.3 v17.12,51.82 | v19.86,45.95 23.09,45.95 v23.19,46.05
  Bottom 0.178: v31.34,37.46 31.34,37.59 31.98,38.23 31.98,39.6 31.57,40 29.24,40 24.74,44.5 24.74,44.78 23.47,46.05 v23.19,46.05 23.11,46.05 22.83,45.77 U1.45 | v17.12,51.82 17.22,51.82 19.76,49.28 19.76,46.05 v19.86,45.95
STAT
  Top 0.203: D11.C 6.88,96.14 U6.1
TVDAC_OUT
  Top 0.356: JP4.1 16.79,79.89 U7.166
TXD
  Top 0.203: JP1.2 44.53,43.38 42.54,45.36 36.82,45.36 U7.51
TXN
  Top 0.152: 49.1,84.33 arc90 J1.4 48.95,86.72 48.64,87.02 48.64,89.53 arc90 47.62,90.55 46.81,90.55 arc90 45.8,89.53 45.8,80.19 | 45.8,60.88 45.8,58.04 arc90 46.81,56.82 49.68,56.85 50.06,56.62 50.22,56.62 U2.56 | 45.8,60.88 45.8,80.19 | C7.1 arc90 45.16,80.19 45.8,80.19 | R17.2 45.06,60.88 45.8,60.88
TXP
  Top 0.152: U2.55 50.27,57.23 47.02,57.23 arc-90 46.2,58.04 46.2,60.88 | 46.2,60.88 46.2,80.19 | 46.2,80.19 46.2,89.53 arc-90 46.81,90.14 47.62,90.14 arc-90 48.23,89.53 arc-90 48.03,89.33 arc180 48.03,88.93 arc-180 48.03,88.52 arc180 48.03,88.11 arc-180 48.03,87.71 arc180 48.03,87.3 arc-127 48.21,86.89 48.03,86.69 48.03,84.38 J1.3 | C5.1 arc-90 46.84,80.19 46.2,80.19 | R5.2 47.04,60.88 46.2,60.88
USBDMP2_N
  Top 0.203: USB1.A2_D- 53.08,36.33 arc90 52.37,37.03 arc-90 49.17,40.23 49.17,46.08 arc-90 50.14,47.04 arc90 50.98,47.88 50.98,51.36 50.98,51.46 50.98,52.04 U2.1
USBDMP2_P
  Top 0.203: USB1.A3_D+ 53.08,38.15 arc-90 52.37,37.44 arc-90 49.58,40.23 49.58,46.08 arc-90 50.14,46.63 arc90 51.38,47.88 51.38,51.99 arc-90 U2.2
USBDMP3_N
  Top 0.203: USB1.B2_D- 55.7,36.68 arc90 55.3,37.08 arc-90 54.2,38.18 54.2,41.86 arc-90 54.89,42.54 arc90 55.27,42.93 55.27,46.69 arc90 54.2,47.75 53.06,47.75 arc-90 51.97,48.84 51.97,52.02 arc90 U2.3
USBDMP3_P
  Top 0.152: 52.37,51.99 arc-90 U2.4
  Top 0.203: USB1.B3_D+ 55.7,37.9 arc-90 55.3,37.49 arc-90 54.61,38.18 54.61,41.86 arc-90 54.89,42.14 arc90 55.68,42.93 55.68,46.69 arc90 54.2,48.16 53.06,48.16 arc-90 52.37,48.84 52.37,51.41 52.37,51.99
VCC_USB2
  Top 0.406: 46.79,34.62 C44.1 | 46.79,34.62 46.79,36.09 C14.1 49.48,37.36 USB1.A1_5V+ | 46.79,34.62 R22.1
VCC_USB3
  Bottom 0.406: USB1.B1_5V+ 54.46,35 51.84,35 49.53,37.31 C15.1 46.66,35.97 C50.1 46.79,34.59 R23.1
VDD18CORE  (via drill 0.38)
  Top 0.203: v61.29,51.56 arc-90 60.17,50.14 58.7,50.16 arc-90 58.04,50.85 U2.15 | v59.77,69.04 58.55,69.06 | 58.55,69.06 57.18,69.06 | 57.18,69.06 56.77,69.06 55.93,68.22 55.93,67.11 C36.1 55.93,66.75 U2.38 | C30.1 57.18,69.06 | C31.1 58.55,69.21 58.55,69.06
  Bottom 0.203: v61.29,51.56 61.37,67.87 arc90 v59.77,69.04
XI
  Top 0.178: 50.22,54.13 49.71,54.13 49.53,54.31 46.15,54.31 45.8,53.95 R28.1
  Top 0.203: Y1.3 44.93,51.06 C37.1 44.96,52.27 44.96,52.37 44.93,52.4 44.93,53.34 45.2,53.61 R28.1 | U2.61 50.22,54.18 50.22,54.13
XO
  Top 0.178: U2.60 44.5,54.69 43.9,54.01 R28.2
  Top 0.203: R28.2 42.29,52.49 C38.1 43.31,51.23 43.31,49.58 41.95,48.23 Y1.1

## Text on the board
tNames: JP1 | ACT | PWR | F1 | J1 | C1 | R24 | FDX | FDX | FDX | RUN | C7 | C5 | C43 | C16 | C30 | C31 | C36 | C46 | R30 | R21 | C34 | R26 | C33 | R17 | R5 | R28 | R25 | C38 | C37 | C28 | C27 | Y1 | RXD | TXD | R23 | TTL Serial | GND | C50 | C15 | USB1 | CS241 | lampertb@stanford.edu | gyifan@stanford.edu | 11-11-15 | Rev1
bNames: R18 | C6 | R6 | C4 | R34 | C51 | R2 | L1 | U$1 | C3 | R1 | R3 | C52 | R35 | L2 | C2 | C8 | R33 | R32 | R9 | R10 | C49 | C48 | R31 | R12 | C47 | BLM | R4 | U5 | R29 | C45 | C23 | R27 | C40 | C35 | C21 | C39 | C25 | BLM1 | C18 | C41 | C17 | C42 | C22 | R20 | R19 | R16 | C29 | C26 | C20 | C24 | C19 | C32 | R13 | R22 | C44 | C14 | R15